# Altium schematic sheet Gestion_batterie_li-ion.SchDoc
size A4; Date: 05/05/2026; Author: Guillaume BEFRE; DrawnBy: Guillaume BEFRE; SheetNumber: 1; SheetTotal: 1
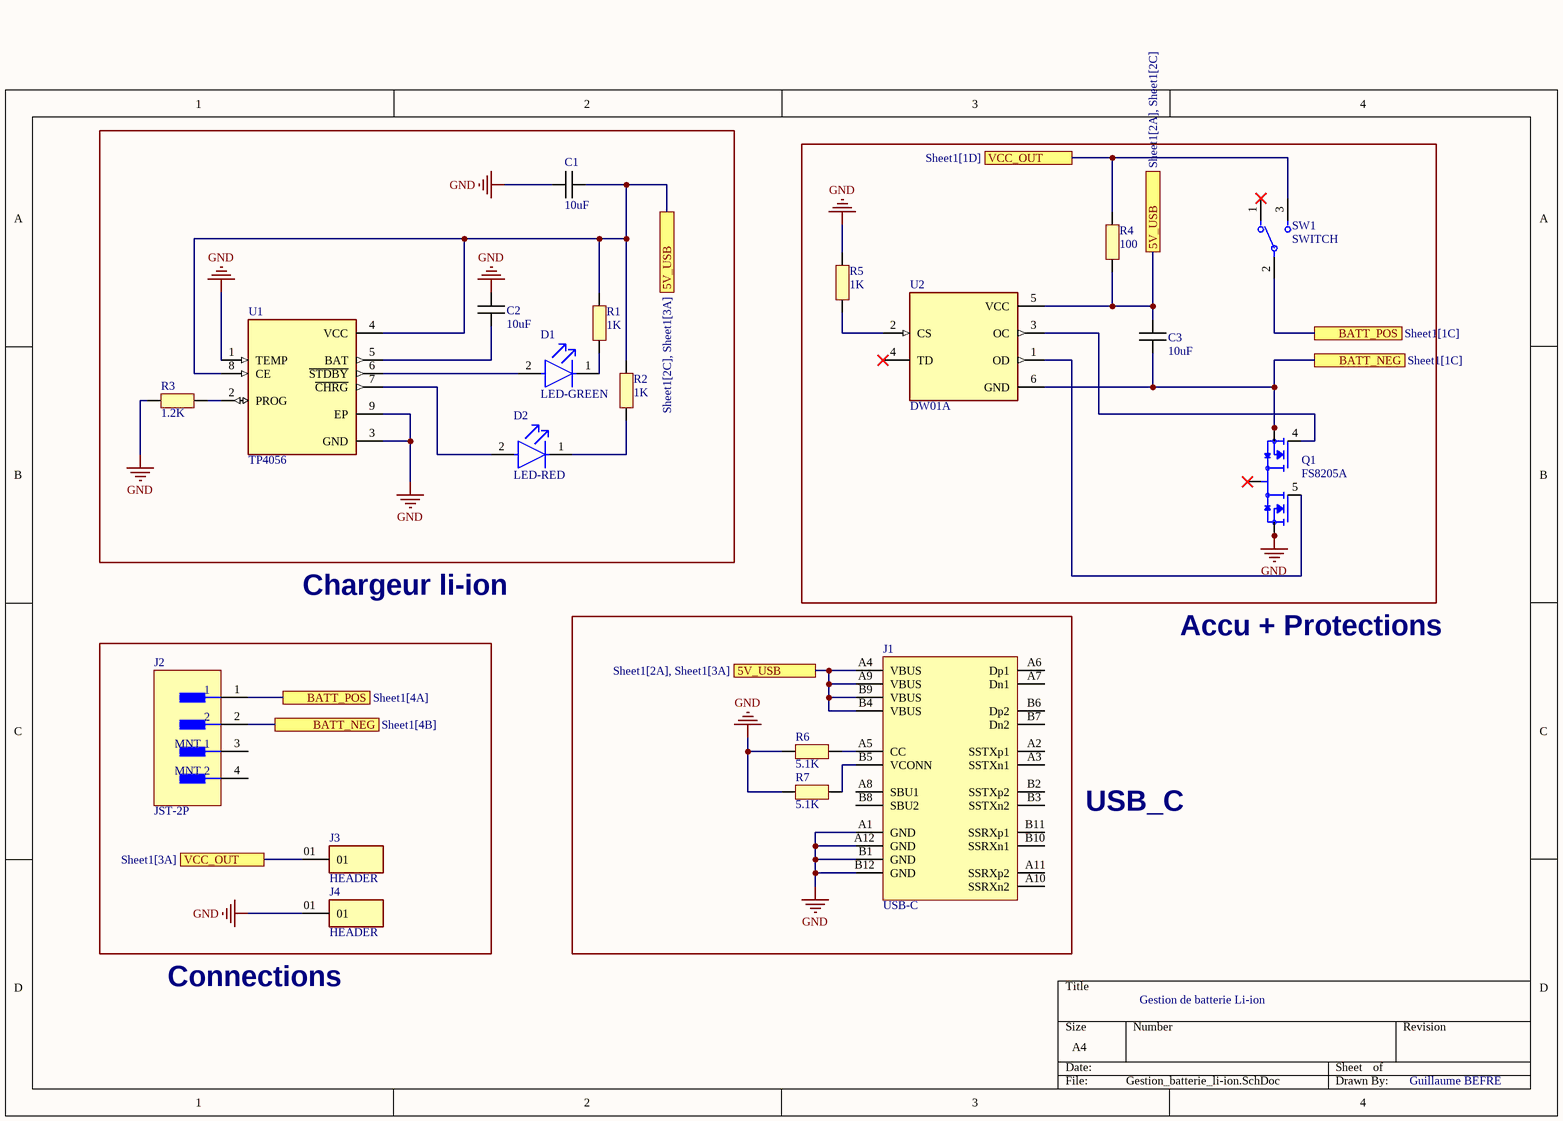
[diagram p0: Gestion_batterie_li-ion.SchDoc]

## Parts
C1  10uF  [SMD-1005-CAP]
C2  10uF  [SMD-1005-CAP]
C3  10uF  [SMD-1005-CAP]
D1  LED-GREEN  [SMD-1608-LED]
D2  LED-RED  [SMD-1608-LED]
J1  USB-C  [USB-C]
J2  JST-2P  [SMD-JST-2P]
J3  HEADER  [HEADER]
J4  HEADER  [HEADER]
Q1  FS8205A  [FS8205A]
R1  1K  [SMD-1005-RES]
R2  1K  [SMD-1005-RES]
R3  1.2K  [SMD-1005-RES]
R4  100  [SMD-1005-RES]
R5  1K  [SMD-1005-RES]
R6  5.1K  [SMD-1005-RES]
R7  5.1K  [SMD-1005-RES]
SW1  SWITCH  [SMD-SWITCH]
U1  TP4056  [SOP-8-TP4056]
U2  DW01A  [DW01A]

## Ports
5V_USB (see Sheet1[2A], Sheet1[2C]), 5V_USB (see Sheet1[2A], Sheet1[3A]), 5V_USB (see Sheet1[2C], Sheet1[3A]), BATT_NEG (see Sheet1[1C]), BATT_NEG (see Sheet1[4B]), BATT_POS (see Sheet1[1C]), BATT_POS (see Sheet1[4A]), VCC_OUT (see Sheet1[1D]), VCC_OUT (see Sheet1[3A])

## Nets
GND: C1.1 C2.2 J1.A1(GND) J1.A12(GND) J1.B1(GND) J1.B12(GND) J4.01 Q1.6(S2) Q1.7(S2) R3.1 R5.2 R6.1 R7.1 U1.1(TEMP) U1.3(GND) U1.9(EP)
5V_USB: C1.2 C3.2 J1.A4(VBUS) J1.A9(VBUS) J1.B4(VBUS) J1.B9(VBUS) R1.2 R2.2 R4.1 U1.4(VCC) U1.8(CE) U2.5(VCC) ; port 5V_USB
BATT_NEG: C3.1 J2.2 Q1.2(S1) Q1.3(S1) U2.6(GND) ; port BATT_NEG
BATT_POS: J2.1 SW1.2(C) ; port BATT_POS
VCC_OUT: J3.01 R4.2 SW1.3 ; port VCC_OUT
NetC2_1: C2.1 U1.5(BAT)
NetD1_1: D1.1(C) R1.1
NetD1_2: D1.2(A) U1.6(~{STDBY})
NetD2_1: D2.1(C) R2.1
NetD2_2: D2.2(A) U1.7(~{CHRG})
NetJ1_A5: J1.A5(CC) R6.2
NetJ1_B5: J1.B5(VCONN) R7.2
NetQ1_1: Q1.1(D12) Q1.8(D12)
NetQ1_4: Q1.4(G1) U2.3(OC)
NetQ1_5: Q1.5(G2) U2.1(OD)
NetR3_2: R3.2 U1.2(PROG)
NetR5_1: R5.1 U2.2(CS)

Not connected (* = marked no-connect by the designer): J1 A2(SSTXp1) A3(SSTXn1) A6(Dp1) A7(Dn1) A8(SBU1) A10(SSRXn2) A11(SSRXp2) B2(SSTXp2) B3(SSTXn2) B6(Dp2) B7(Dn2) B8(SBU2) B10(SSRXn1) B11(SSRXp1); J2 3(MNT_1) 4(MNT_2); SW1 1*; U2 4(TD)*

## Notes on the sheet
- Chargeur li-ion
- Accu + Protections
- USB_C
- (near J4) Connections
- Gestion de batterie Li-ion

## Library data of the parts
C1-C3 = CAPACITOR
D1 = LED-GREEN: LED GREEN CLEAR CHIP SMD LTST-C190GKT; Dominant Wavelength: 569nm; Reverse Voltage: 5V; Lens Color: Colorless; Viewing Angle: 130°; Voltage: 2V; Forward Current: 30mA; Power Dissipation: 100mW; Luminous Intensity: 6mcd; Number of LEDs: 1; Forward Voltage: 2.1V; Wavelength: 565nm; Test Current: 10mA; Min Operating Temperature: -55°C; Lens Style: Clear; Mount: Surface Mount; Width: 0.8mm; Packaging: Tape and Reel; Lens Transparency: Clear; Case Code (Metric): 1608; Depth: 0.8mm; Case Code (Imperial): 0603; Case/Package: 0603; Number of Pins: 2; Max Operating Temperature: 85°C; Lead Free: Lead Free; Number of Elements: 1; Length: 1.6mm; Height: 0.8mm; Package Quantity: 1; Power Rating: 100mW; Radiation Hardening: No; Illumination Color: Green; Color: Green
D2 = LED-RED: LED GREEN CLEAR CHIP SMD LTST-C190GKT; Dominant Wavelength: 569nm; Reverse Voltage: 5V; Lens Color: Colorless; Viewing Angle: 130°; Voltage: 2V; Forward Current: 30mA; Power Dissipation: 100mW; Luminous Intensity: 6mcd; Number of LEDs: 1; Forward Voltage: 2.1V; Wavelength: 565nm; Test Current: 10mA; Min Operating Temperature: -55°C; Lens Style: Clear; Mount: Surface Mount; Width: 0.8mm; Packaging: Tape and Reel; Lens Transparency: Clear; Case Code (Metric): 1608; Depth: 0.8mm; Case Code (Imperial): 0603; Case/Package: 0603; Number of Pins: 2; Max Operating Temperature: 85°C; Lead Free: Lead Free; Number of Elements: 1; Length: 1.6mm; Height: 0.8mm; Package Quantity: 1; Power Rating: 100mW; Radiation Hardening: No; Illumination Color: Green; Color: Green
J1 = USB-C: NexarPartId: 68112675; Pin Length: 1.9mm; Current Rating: 5A; Gender: Receptacle; Voltage Rating: 20V; Number of Contacts: 24; Insulation Resistance: 1GΩ; USB Standard: USB 3.1; Connector Type: USB; Contact Resistance: 30mΩ; Min Operating Temperature: -40°C; Mount: Surface Mount, Through Hole; Height: 3.21mm; Number of Pins: 24; RoHS: Compliant; Orientation: Horizontal; Max Operating Temperature: 105°C; Packaging: Tape and Reel; Contact Material: Gold, Nickel
J2 = JST-2P: Connector Header Surface Mount, Right Angle 2 position 0.079" (2.00mm); NexarPartId: 22059567; Number of Contacts: 2; Gender: Male; Voltage Rating: 250V; Current Rating: 3A; Packaging: Cut Tape; Height: 5.7mm; Max Operating Temperature: 85°C; Mount: Surface Mount; Termination: SMD/SMT; Min Operating Temperature: -25°C; Number of Rows: 1; Contact Plating: Tin; Lead Free: Lead Free; RoHS: Compliant; Contact Material: Copper
J3 J4 = HEADER: Connector Header Through Hole 1 position; MF: Samtec; MP: MTMM-101-05-G-S-225; SnapEDA_Link: https://www.snapeda.com/parts/MTMM-101-05-G-S-225/Samtec/view-part/?ref=snap; Package: None; Value: *; Check_prices: https://www.snapeda.com/parts/MTMM-101-05-G-S-225/Samtec/view-part/?ref=eda
Q1 = FS8205A: N/A; MF: Fortune Semiconductor; MP: FS8205A; Value: *; Availability: Not in stock; Package: Package; Price: None; SnapEDA_Link: https://www.snapeda.com/parts/FS8205A/Fortune+Semiconductor/view-part/?ref=snap; Check_prices: https://www.snapeda.com/parts/FS8205A/Fortune+Semiconductor/view-part/?ref=eda
R1-R7 = RESISTOR
SW1 = SWITCH: SWITCH SLIDE SPDT 300MA 6V JS102011SCQN; Electrical Life: 5000Cycles; Actuator Type: Standard; Contact Resistance: 70mR; Actuator Material: Nylon; Max Voltage Rating (DC): 30V; Actuator Length: 2mm; Switch Function: On-On; Actuator Color: Black; Radiation Hardening: No; Throw Configuration: SPDT; Depth: 7.5mm; Case/Package: SMD/SMT; Package Quantity: 4000; Min Operating Temperature: -40°C; Length: 8.5mm; Current Rating: 300mA; Mount: Surface Mount; Voltage Rating (DC): 6V; RoHS Compliant: Yes; Orientation: Straight; Housing Material: Nylon; Contact Plating: Silver; Max Operating Temperature: 85°C; Packaging: Tape and Reel; Switch Travel: 2mm; Max Current Rating: 300mA; Contact Material: Copper Alloy; Series: JS; Termination: Gull Wing
U1 = TP4056: Complete single cell Li-Ion battery with a constant current / constant voltage linear charger; MF: NanJing Top Power ASIC Corp.; Check_prices: https://www.snapeda.com/parts/TP4056/NanJing+Top+Power+ASIC+Corp./view-part/?ref=eda; SnapEDA_Link: https://www.snapeda.com/parts/TP4056/NanJing+Top+Power+ASIC+Corp./view-part/?ref=snap; Price: None; Availability: Not in stock; Package: Package; MP: TP4056; Value: *
U2 = DW01A: One Cell Lithium-ion/Polymer Battery Protection IC; MF: Fortune Semiconductor; SnapEDA_Link: https://www.snapeda.com/parts/DW01A/Fortune+Semiconductor/view-part/?ref=snap; Package: SOT-23-6 Fortune Semiconductor; Value: *; MP: DW01A; Check_prices: https://www.snapeda.com/parts/DW01A/Fortune+Semiconductor/view-part/?ref=eda